# Altium schematic sheet Intro.SchDoc
size D; DocumentNumber: 1; SheetNumber: 1
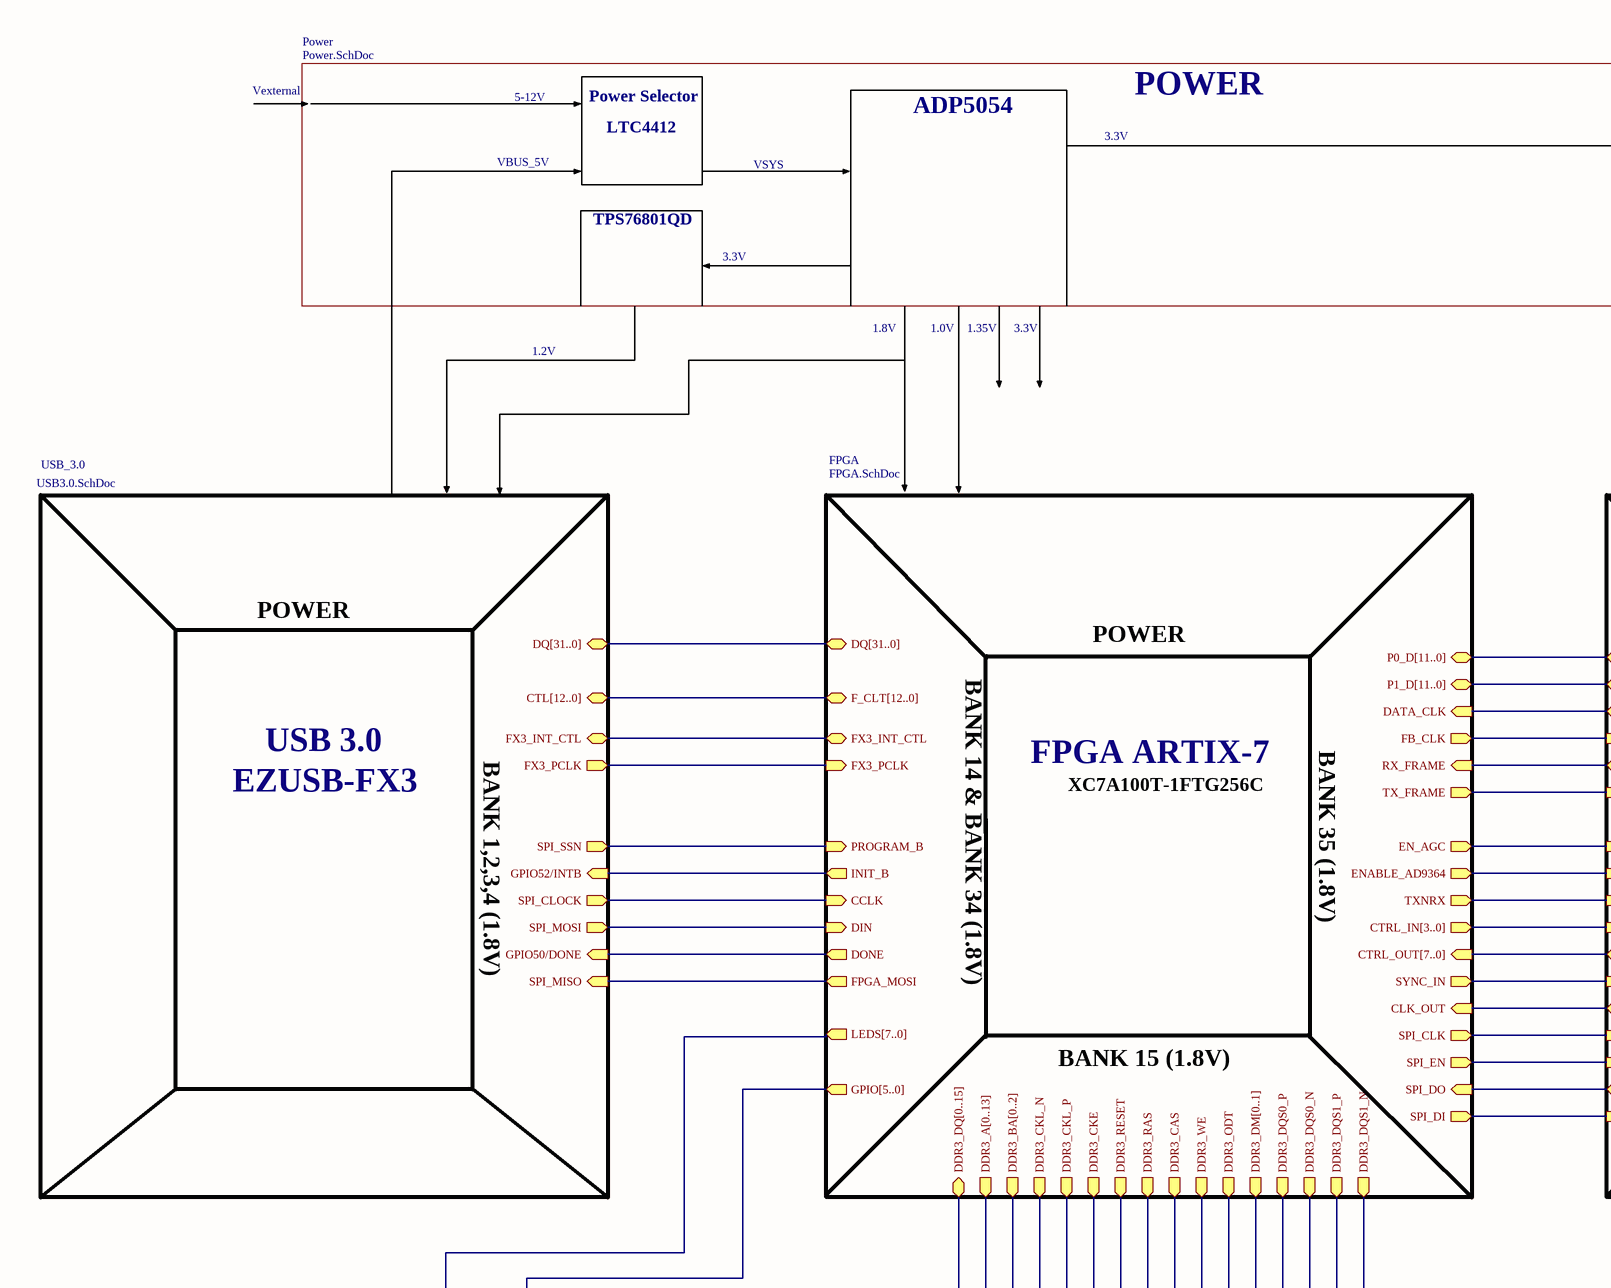
[diagram p0: Intro.SchDoc, top left]
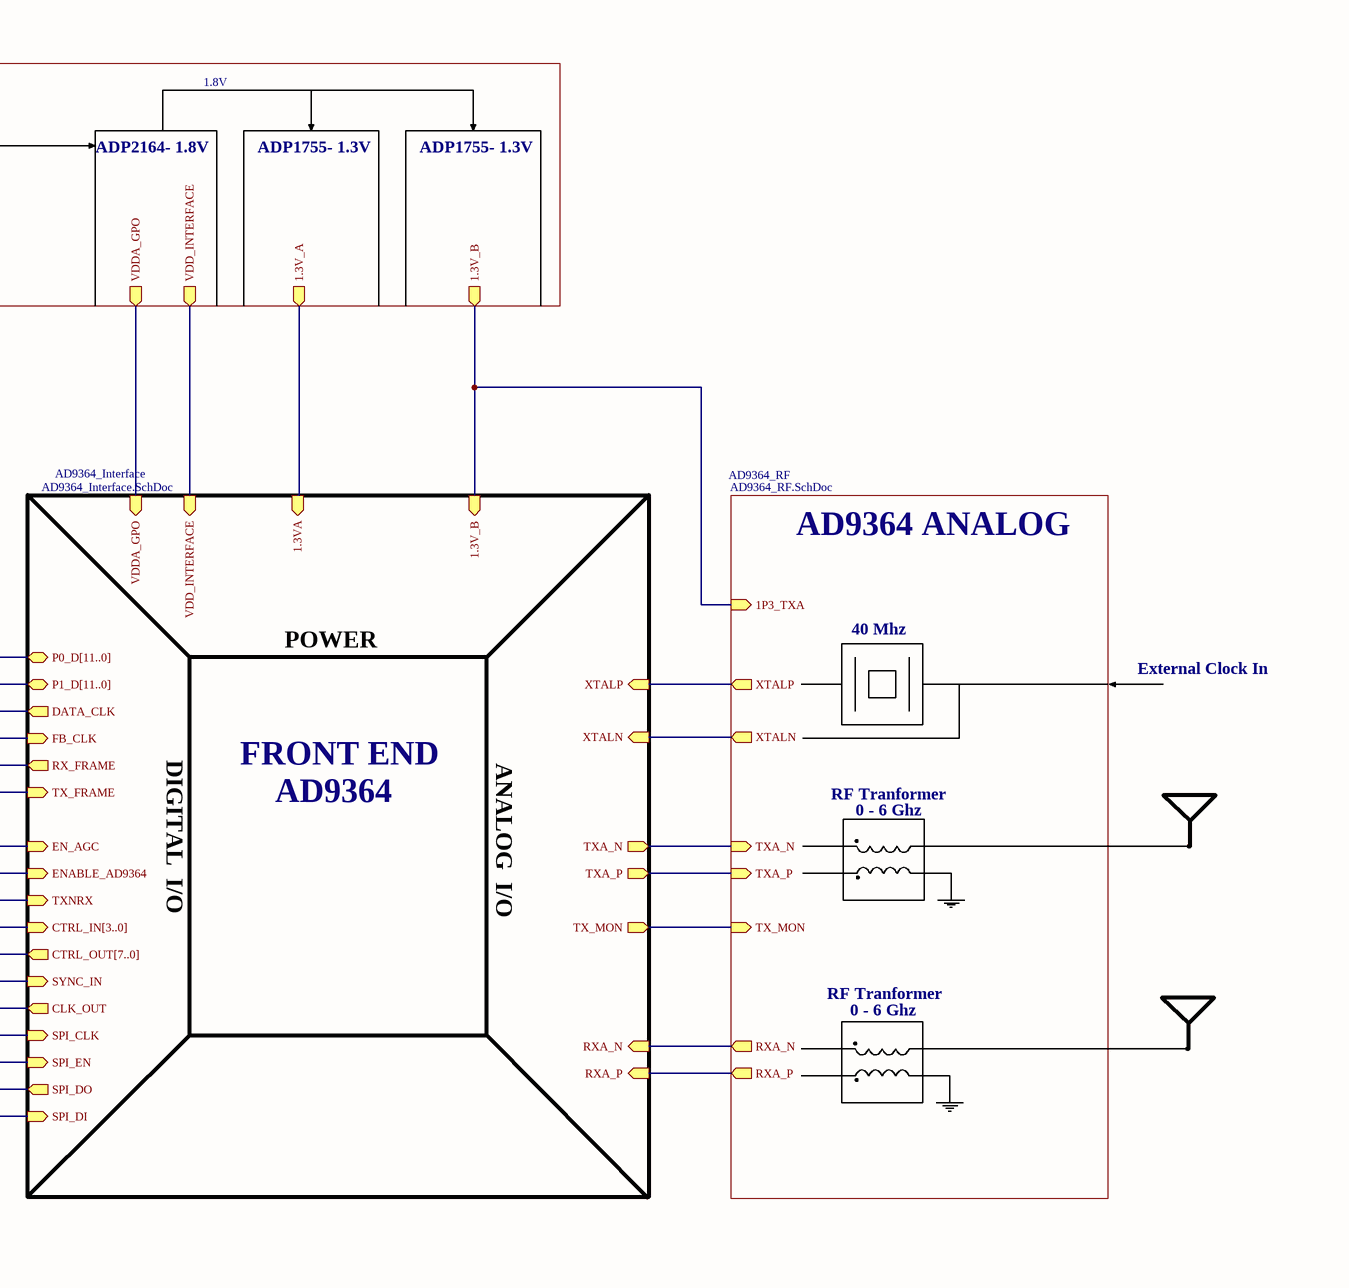
[diagram p1: Intro.SchDoc, top right]
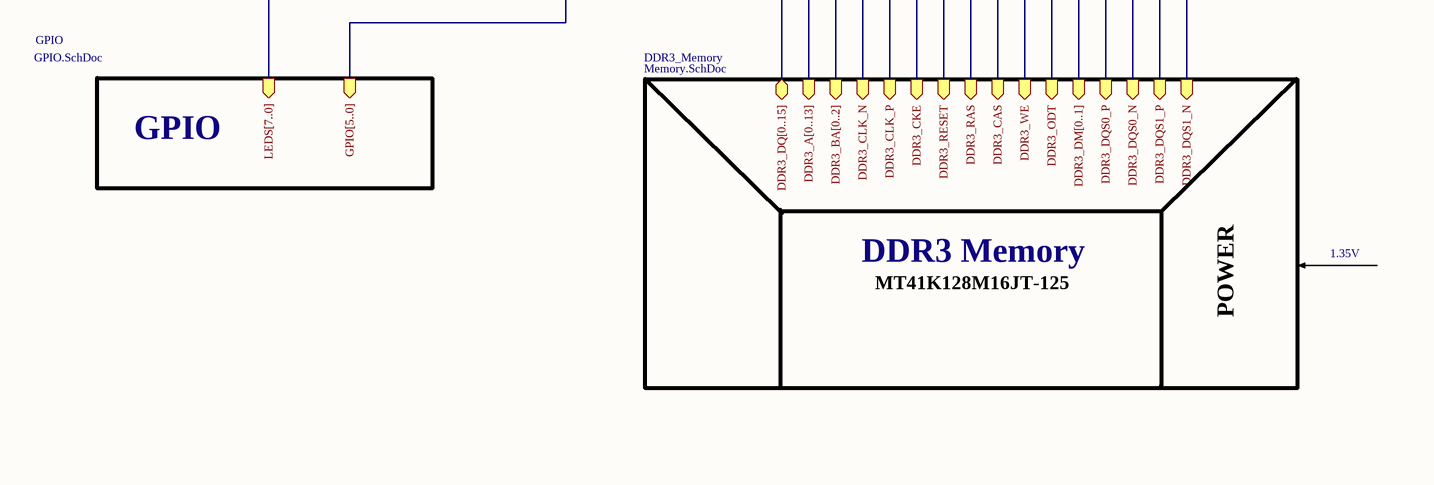
[diagram p2: Intro.SchDoc, bottom left]
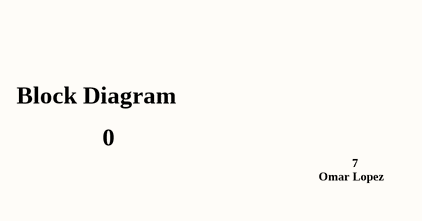
[diagram p3: Intro.SchDoc, bottom right]

## Sub-sheets
AD9364_Interface = AD9364_Interface.SchDoc: P0_D[11..0] (bidir), P1_D[11..0] (bidir), CTRL_IN[3..0] (in), CTRL_OUT[7..0] (out), DATA_CLK (out), FB_CLK (in), RX_FRAME (out), TX_FRAME (in), ENABLE_AD9364 (in), EN_AGC (in), TXNRX (in), SPI_EN (in), SPI_CLK (in), SPI_DI (in), SPI_DO (out), SYNC_IN (in), CLK_OUT (out), VDD_INTERFACE (in), 1.3V_B (in), 1.3VA (in), VDDA_GPO (in), XTALN (in), XTALP (in), TXA_N (out), TXA_P (out), TX_MON (out), RXA_N (in), RXA_P (in)
AD9364_RF = AD9364_RF.SchDoc: XTALN (out), TXA_N (in), XTALP (out), TXA_P (in), TX_MON (in), RXA_N (out), RXA_P (out), 1P3_TXA (in)
DDR3_Memory = Memory.SchDoc: DDR3_DQ[0..15] (bidir), DDR3_A[0..13] (in), DDR3_BA[0..2] (in), DDR3_CLK_N (in), DDR3_CKE (in), DDR3_RESET (in), DDR3_RAS (in), DDR3_CAS (in), DDR3_WE (in), DDR3_ODT (in), DDR3_DM[0..1] (in), DDR3_DQS0_P (in), DDR3_DQS1_P (in), DDR3_DQS0_N (in), DDR3_DQS1_N (in), DDR3_CLK_P (in)
FPGA = FPGA.SchDoc: P0_D[11..0] (bidir), P1_D[11..0] (bidir), DATA_CLK (in), FB_CLK (out), RX_FRAME (in), TXNRX (out), TX_FRAME (out), EN_AGC (out), ENABLE_AD9364 (out), F_CLT[12..0] (bidir), DQ[31..0] (bidir), FX3_INT_CTL (bidir), FX3_PCLK (in), SPI_DO (in), SPI_EN (out), SPI_CLK (out), CLK_OUT (in), SYNC_IN (out), CTRL_OUT[7..0] (in), CTRL_IN[3..0] (out), SPI_DI (out), DDR3_DQ[0..15] (bidir), DDR3_A[0..13] (out), DDR3_BA[0..2] (out), DDR3_CKL_N (out), DDR3_CKE (out), DDR3_RESET (out), DDR3_RAS (out), DDR3_CAS (out), DDR3_WE (out), DDR3_ODT (out), DDR3_DM[0..1] (out), DDR3_DQS0_P (out), DDR3_DQS1_P (out), DDR3_DQS0_N (out), DDR3_DQS1_N (out), DDR3_CKL_P (out), LEDS[7..0] (out), PROGRAM_B (in), INIT_B (out), CCLK (in), DIN (in), DONE (out), FPGA_MOSI (out), GPIO[5..0] (out)
GPIO = GPIO.SchDoc: LEDS[7..0] (in), GPIO[5..0] (in)
Power = Power.SchDoc: VDD_INTERFACE (out), VDDA_GPO (out), 1.3V_A (out), 1.3V_B (out)
USB_3.0 = USB3.0.SchDoc: FX3_INT_CTL (bidir), FX3_PCLK (out), DQ[31..0] (bidir), CTL[12..0] (bidir), SPI_SSN (out), GPIO52/INTB (in), SPI_CLOCK (out), SPI_MOSI (out), GPIO50/DONE (in), SPI_MISO (in)

## Nets
(unnamed): sheet AD9364_Interface/DATA_CLK, sheet FPGA/DATA_CLK
(unnamed): sheet AD9364_Interface/FB_CLK, sheet FPGA/FB_CLK
(unnamed): sheet AD9364_Interface/RX_FRAME, sheet FPGA/RX_FRAME
(unnamed): sheet AD9364_Interface/TX_FRAME, sheet FPGA/TX_FRAME
(unnamed): sheet AD9364_Interface/ENABLE_AD9364, sheet FPGA/ENABLE_AD9364
(unnamed): sheet AD9364_Interface/EN_AGC, sheet FPGA/EN_AGC
(unnamed): sheet AD9364_Interface/TXNRX, sheet FPGA/TXNRX
(unnamed): sheet AD9364_Interface/SPI_EN, sheet FPGA/SPI_EN
(unnamed): sheet AD9364_Interface/SPI_CLK, sheet FPGA/SPI_CLK
(unnamed): sheet AD9364_Interface/SPI_DI, sheet FPGA/SPI_DI
(unnamed): sheet AD9364_Interface/SPI_DO, sheet FPGA/SPI_DO
(unnamed): sheet AD9364_Interface/SYNC_IN, sheet FPGA/SYNC_IN
(unnamed): sheet AD9364_Interface/CLK_OUT, sheet FPGA/CLK_OUT
(unnamed): sheet AD9364_Interface/VDD_INTERFACE, sheet Power/VDD_INTERFACE
(unnamed): sheet AD9364_Interface/1.3V_B, sheet Power/1.3V_B, sheet AD9364_RF/1P3_TXA
(unnamed): sheet AD9364_Interface/1.3VA, sheet Power/1.3V_A
(unnamed): sheet AD9364_Interface/VDDA_GPO, sheet Power/VDDA_GPO
(unnamed): sheet AD9364_Interface/XTALN, sheet AD9364_RF/XTALN
(unnamed): sheet AD9364_Interface/XTALP, sheet AD9364_RF/XTALP
(unnamed): sheet AD9364_Interface/TXA_N, sheet AD9364_RF/TXA_N
(unnamed): sheet AD9364_Interface/TXA_P, sheet AD9364_RF/TXA_P
(unnamed): sheet AD9364_Interface/TX_MON, sheet AD9364_RF/TX_MON
(unnamed): sheet AD9364_Interface/RXA_N, sheet AD9364_RF/RXA_N
(unnamed): sheet AD9364_Interface/RXA_P, sheet AD9364_RF/RXA_P
(unnamed): sheet USB_3.0/FX3_INT_CTL, sheet FPGA/FX3_INT_CTL
(unnamed): sheet USB_3.0/FX3_PCLK, sheet FPGA/FX3_PCLK
(unnamed): sheet USB_3.0/SPI_SSN, sheet FPGA/PROGRAM_B
(unnamed): sheet USB_3.0/GPIO52/INTB, sheet FPGA/INIT_B
(unnamed): sheet USB_3.0/SPI_CLOCK, sheet FPGA/CCLK
(unnamed): sheet USB_3.0/SPI_MOSI, sheet FPGA/DIN
(unnamed): sheet USB_3.0/GPIO50/DONE, sheet FPGA/DONE
(unnamed): sheet USB_3.0/SPI_MISO, sheet FPGA/FPGA_MOSI
(unnamed): sheet FPGA/DDR3_CKL_N, sheet DDR3_Memory/DDR3_CLK_N
(unnamed): sheet FPGA/DDR3_CKE, sheet DDR3_Memory/DDR3_CKE
(unnamed): sheet FPGA/DDR3_RESET, sheet DDR3_Memory/DDR3_RESET
(unnamed): sheet FPGA/DDR3_RAS, sheet DDR3_Memory/DDR3_RAS
(unnamed): sheet FPGA/DDR3_CAS, sheet DDR3_Memory/DDR3_CAS
(unnamed): sheet FPGA/DDR3_WE, sheet DDR3_Memory/DDR3_WE
(unnamed): sheet FPGA/DDR3_ODT, sheet DDR3_Memory/DDR3_ODT
(unnamed): sheet FPGA/DDR3_DQS0_P, sheet DDR3_Memory/DDR3_DQS0_P
(unnamed): sheet FPGA/DDR3_DQS1_P, sheet DDR3_Memory/DDR3_DQS1_P
(unnamed): sheet FPGA/DDR3_DQS0_N, sheet DDR3_Memory/DDR3_DQS0_N
(unnamed): sheet FPGA/DDR3_DQS1_N, sheet DDR3_Memory/DDR3_DQS1_N
(unnamed): sheet FPGA/DDR3_CKL_P, sheet DDR3_Memory/DDR3_CLK_P

## Buses and harness runs
bus sheet AD9364_Interface/CTRL_IN[3..0] = sheet FPGA/CTRL_IN[3..0]
bus sheet AD9364_Interface/CTRL_OUT[7..0] = sheet FPGA/CTRL_OUT[7..0]
bus sheet AD9364_Interface/P0_D[11..0] = sheet FPGA/P0_D[11..0]
bus sheet AD9364_Interface/P1_D[11..0] = sheet FPGA/P1_D[11..0]
bus sheet DDR3_Memory/DDR3_A[0..13] = sheet FPGA/DDR3_A[0..13]
bus sheet DDR3_Memory/DDR3_BA[0..2] = sheet FPGA/DDR3_BA[0..2]
bus sheet DDR3_Memory/DDR3_DM[0..1] = sheet FPGA/DDR3_DM[0..1]
bus sheet DDR3_Memory/DDR3_DQ[0..15] = sheet FPGA/DDR3_DQ[0..15]
bus sheet FPGA/DQ[31..0] = sheet USB_3.0/DQ[31..0]
bus sheet FPGA/F_CLT[12..0] = sheet USB_3.0/CTL[12..0]
bus sheet FPGA/GPIO[5..0] = sheet GPIO/GPIO[5..0]
bus sheet FPGA/LEDS[7..0] = sheet GPIO/LEDS[7..0]

## Notes on the sheet
- Vexternal
- 5-12V
- Power Selector
- LTC4412
- ADP5054
- 3.3V
- POWER
- 1.8V
- VBUS_5V
- VSYS
- ADP2164- 1.8V
- ADP1755- 1.3V
- TPS76801QD
- 1.0V
- 1.35V
- 1.2V
- AD9364 ANALOG
- 40 Mhz
- External Clock In
- EZUSB-FX3
- USB 3.0
- FPGA ARTIX-7
- XC7A100T-1FTG256C
- FRONT END
- AD9364
- RF Tranformer
- 0 - 6 Ghz
- BANK 1,2,3,4 (1.8V)
- BANK 14 & BANK 34 (1.8V)
- BANK 35 (1.8V)
- DIGITAL  I/O
- ANALOG  I/O
- BANK 15 (1.8V)
- GPIO
- DDR3 Memory
- MT41K128M16JT-125
- Block Diagram
- 0
- Omar Lopez
- 7